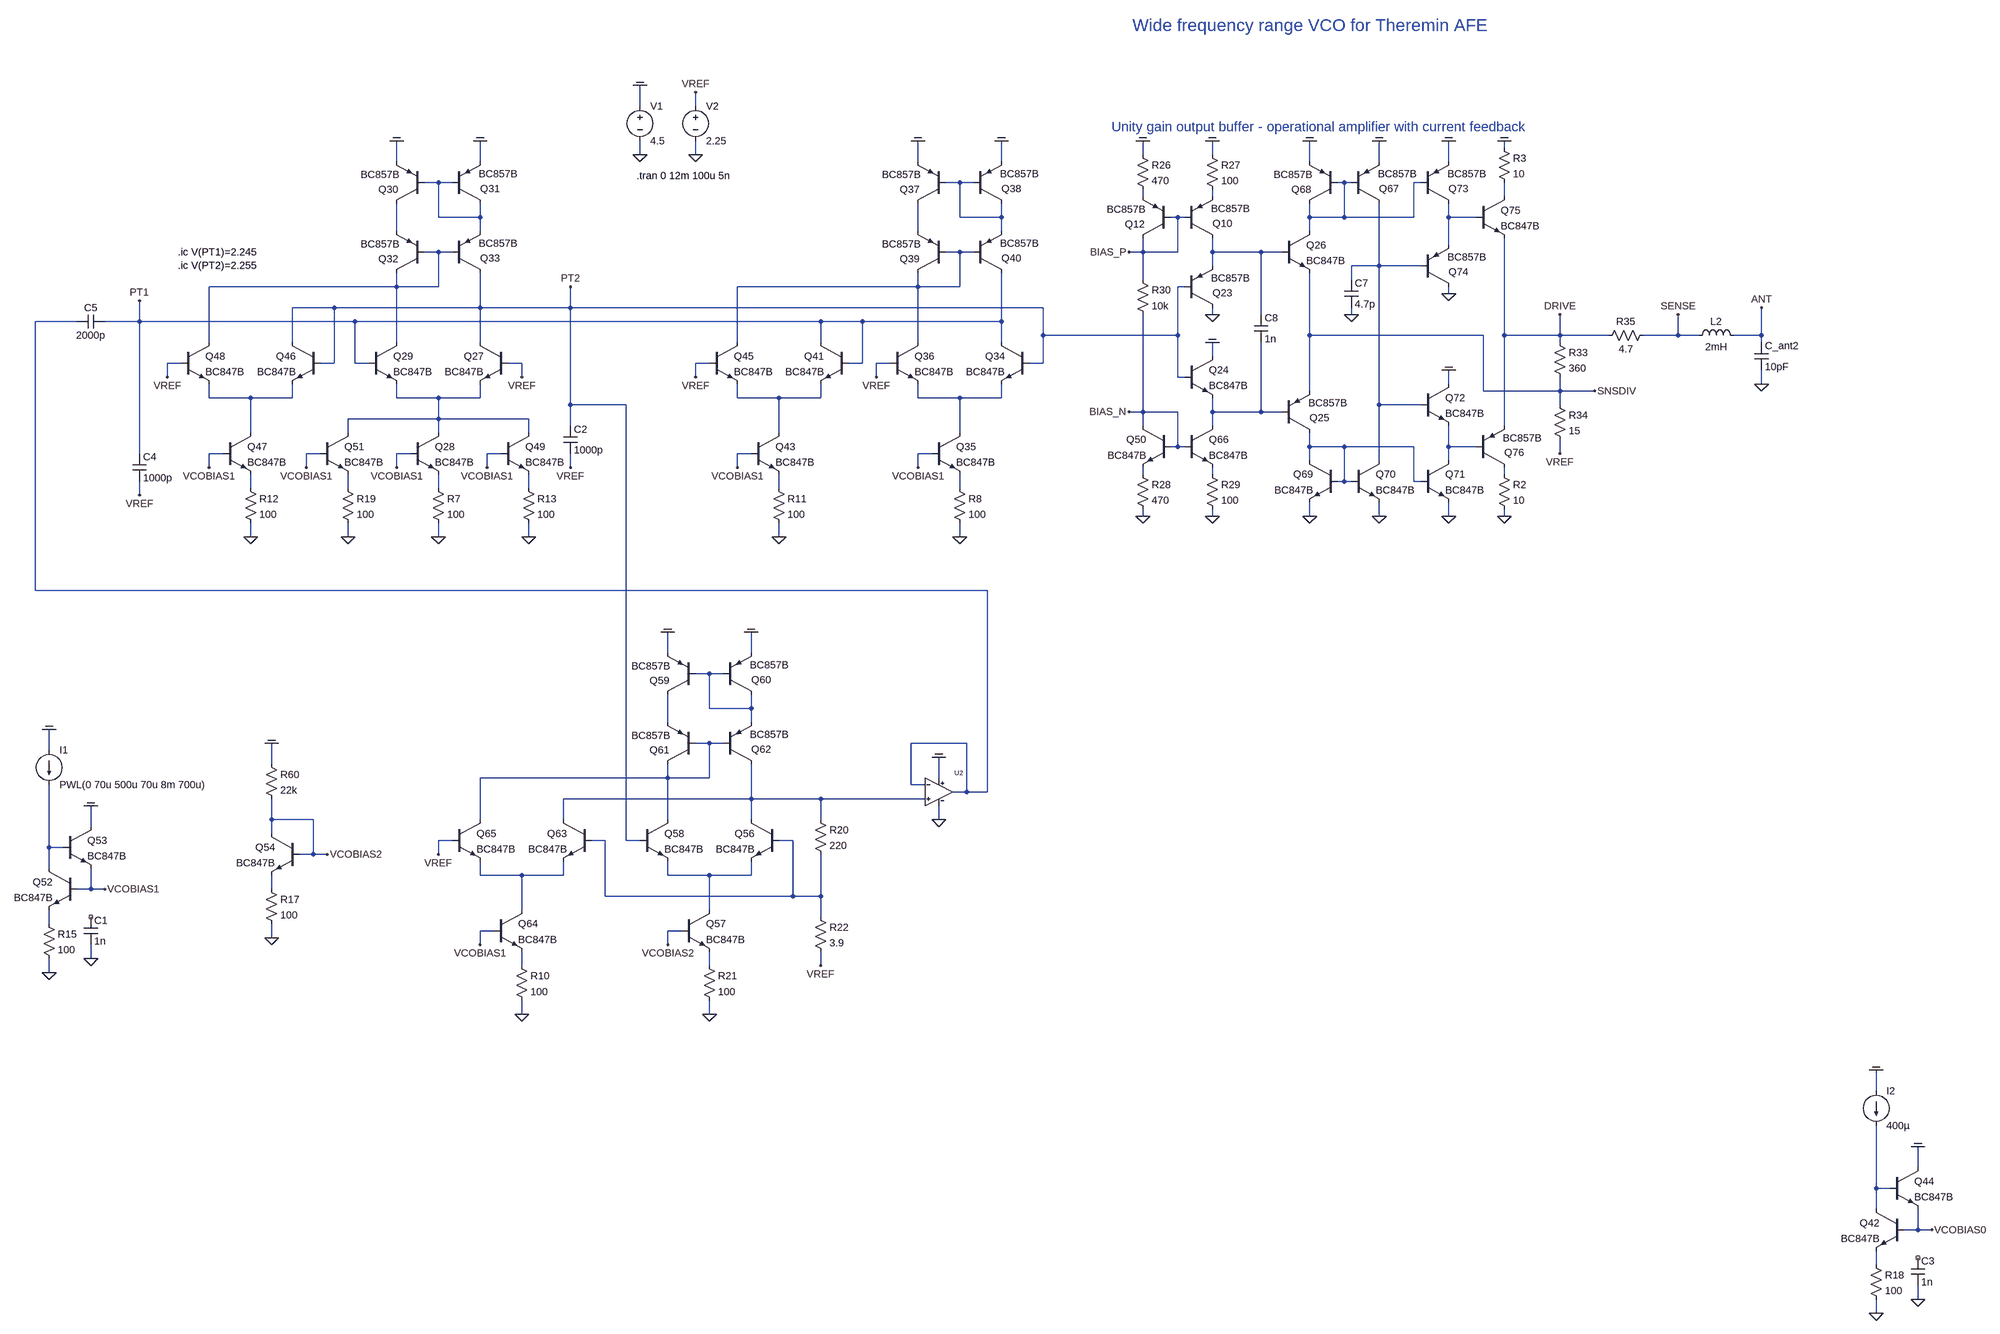
[diagram p0: schematic vco_sine_bjt_v12.asc]
vco_sine_bjt_v12.asc, the LTspice schematic file:
Version 4
SHEET 1 13504 21184
WIRE -5232 15680 -5232 15632
WIRE -5104 15680 -5104 15648
WIRE -2944 15776 -2944 15760
WIRE -5232 15792 -5232 15760
WIRE -5104 15792 -5104 15760
WIRE -3776 15792 -3776 15760
WIRE -3616 15792 -3616 15760
WIRE -5792 15808 -5792 15760
WIRE -5600 15808 -5600 15760
WIRE -4592 15808 -4592 15760
WIRE -4400 15808 -4400 15760
WIRE -3392 15808 -3392 15760
WIRE -3232 15808 -3232 15760
WIRE -3072 15808 -3072 15760
WIRE -5696 15856 -5728 15856
WIRE -5664 15856 -5696 15856
WIRE -4496 15856 -4528 15856
WIRE -4464 15856 -4496 15856
WIRE -3312 15856 -3328 15856
WIRE -3296 15856 -3312 15856
WIRE -3136 15856 -3152 15856
WIRE -3776 15888 -3776 15872
WIRE -3616 15888 -3616 15872
WIRE -2944 15888 -2944 15856
WIRE -5696 15936 -5696 15856
WIRE -5600 15936 -5600 15904
WIRE -5600 15936 -5696 15936
WIRE -4496 15936 -4496 15856
WIRE -4400 15936 -4400 15904
WIRE -4400 15936 -4496 15936
WIRE -3696 15936 -3712 15936
WIRE -3680 15936 -3696 15936
WIRE -3392 15936 -3392 15904
WIRE -3312 15936 -3312 15856
WIRE -3312 15936 -3392 15936
WIRE -3152 15936 -3152 15856
WIRE -3152 15936 -3312 15936
WIRE -3072 15936 -3072 15904
WIRE -3008 15936 -3072 15936
WIRE -5792 15968 -5792 15904
WIRE -5600 15968 -5600 15936
WIRE -4592 15968 -4592 15904
WIRE -4400 15968 -4400 15936
WIRE -3392 15968 -3392 15936
WIRE -3072 16000 -3072 15936
WIRE -5696 16016 -5728 16016
WIRE -5664 16016 -5696 16016
WIRE -4496 16016 -4528 16016
WIRE -4464 16016 -4496 16016
WIRE -3776 16016 -3776 15984
WIRE -3776 16016 -3808 16016
WIRE -3696 16016 -3696 15936
WIRE -3696 16016 -3776 16016
WIRE -3616 16016 -3616 15984
WIRE -3504 16016 -3616 16016
WIRE -3456 16016 -3504 16016
WIRE -3616 16048 -3616 16016
WIRE -3232 16048 -3232 15904
WIRE -3232 16048 -3296 16048
WIRE -3136 16048 -3232 16048
WIRE -3776 16080 -3776 16016
WIRE -3296 16080 -3296 16048
WIRE -5792 16096 -5792 16064
WIRE -5792 16096 -6224 16096
WIRE -5696 16096 -5696 16016
WIRE -5696 16096 -5792 16096
WIRE -4592 16096 -4592 16064
WIRE -4592 16096 -5008 16096
WIRE -4496 16096 -4496 16016
WIRE -4496 16096 -4592 16096
WIRE -3680 16096 -3696 16096
WIRE -3072 16112 -3072 16096
WIRE -5936 16144 -6032 16144
WIRE -5600 16144 -5600 16064
WIRE -5600 16144 -5936 16144
WIRE -5392 16144 -5392 16096
WIRE -5392 16144 -5600 16144
WIRE -4304 16144 -5392 16144
WIRE -3616 16160 -3616 16144
WIRE -3504 16160 -3504 16016
WIRE -3296 16160 -3296 16144
WIRE -6528 16176 -6624 16176
WIRE -6384 16176 -6384 16128
WIRE -6384 16176 -6464 16176
WIRE -5888 16176 -6384 16176
WIRE -4816 16176 -5888 16176
WIRE -4720 16176 -4816 16176
WIRE -4400 16176 -4400 16064
WIRE -4400 16176 -4720 16176
WIRE -4304 16208 -4304 16144
WIRE -3696 16208 -3696 16096
WIRE -3696 16208 -4304 16208
WIRE -3392 16208 -3392 16064
WIRE -2992 16208 -3392 16208
WIRE -2944 16208 -2944 15984
WIRE -2816 16208 -2816 16160
WIRE -2816 16208 -2944 16208
WIRE -2704 16208 -2816 16208
WIRE -2544 16208 -2544 16160
WIRE -2544 16208 -2624 16208
WIRE -2496 16208 -2544 16208
WIRE -2352 16208 -2352 16144
WIRE -2352 16208 -2416 16208
WIRE -6224 16224 -6224 16096
WIRE -6032 16224 -6032 16144
WIRE -5792 16224 -5792 16096
WIRE -5600 16224 -5600 16144
WIRE -5008 16224 -5008 16096
WIRE -4816 16224 -4816 16176
WIRE -4592 16224 -4592 16096
WIRE -4400 16224 -4400 16176
WIRE -2816 16224 -2816 16208
WIRE -2352 16224 -2352 16208
WIRE -3616 16256 -3616 16224
WIRE -6288 16272 -6320 16272
WIRE -5936 16272 -5936 16144
WIRE -5936 16272 -5968 16272
WIRE -5888 16272 -5888 16176
WIRE -5856 16272 -5888 16272
WIRE -5504 16272 -5536 16272
WIRE -5072 16272 -5104 16272
WIRE -4720 16272 -4720 16176
WIRE -4720 16272 -4752 16272
WIRE -4656 16272 -4688 16272
WIRE -4304 16272 -4304 16208
WIRE -4304 16272 -4336 16272
WIRE -6320 16304 -6320 16272
WIRE -5504 16304 -5504 16272
WIRE -5104 16304 -5104 16272
WIRE -4688 16304 -4688 16272
WIRE -3696 16304 -3696 16208
WIRE -3680 16304 -3696 16304
WIRE -3072 16320 -3072 16288
WIRE -2352 16320 -2352 16288
WIRE -3392 16336 -3392 16208
WIRE -2992 16336 -2992 16208
WIRE -2816 16336 -2816 16304
WIRE -2816 16336 -2992 16336
WIRE -2736 16336 -2816 16336
WIRE -6224 16352 -6224 16320
WIRE -6128 16352 -6224 16352
WIRE -6032 16352 -6032 16320
WIRE -6032 16352 -6128 16352
WIRE -5792 16352 -5792 16320
WIRE -5696 16352 -5792 16352
WIRE -5600 16352 -5600 16320
WIRE -5600 16352 -5696 16352
WIRE -5008 16352 -5008 16320
WIRE -4912 16352 -5008 16352
WIRE -4816 16352 -4816 16320
WIRE -4816 16352 -4912 16352
WIRE -4592 16352 -4592 16320
WIRE -4496 16352 -4592 16352
WIRE -4400 16352 -4400 16320
WIRE -4400 16352 -4496 16352
WIRE -5392 16368 -5392 16144
WIRE -5264 16368 -5392 16368
WIRE -3232 16368 -3232 16048
WIRE -3136 16368 -3232 16368
WIRE -2816 16368 -2816 16336
WIRE -3776 16384 -3776 16160
WIRE -3776 16384 -3808 16384
WIRE -3696 16384 -3776 16384
WIRE -3616 16384 -3616 16352
WIRE -3504 16384 -3504 16224
WIRE -3504 16384 -3616 16384
WIRE -3456 16384 -3504 16384
WIRE -5696 16400 -5696 16352
WIRE -5696 16400 -5904 16400
WIRE -5488 16400 -5696 16400
WIRE -5392 16416 -5392 16368
WIRE -3776 16416 -3776 16384
WIRE -3616 16416 -3616 16384
WIRE -2944 16416 -2944 16208
WIRE -6128 16432 -6128 16352
WIRE -5904 16432 -5904 16400
WIRE -5696 16432 -5696 16400
WIRE -5488 16432 -5488 16400
WIRE -4912 16432 -4912 16352
WIRE -4496 16432 -4496 16352
WIRE -3696 16464 -3696 16384
WIRE -3696 16464 -3712 16464
WIRE -3680 16464 -3696 16464
WIRE -3392 16464 -3392 16432
WIRE -3312 16464 -3392 16464
WIRE -3152 16464 -3312 16464
WIRE -3072 16464 -3072 16416
WIRE -3008 16464 -3072 16464
WIRE -6384 16480 -6384 16176
WIRE -6192 16480 -6224 16480
WIRE -5968 16480 -6000 16480
WIRE -5760 16480 -5792 16480
WIRE -5552 16480 -5584 16480
WIRE -4976 16480 -5008 16480
WIRE -4560 16480 -4592 16480
WIRE -2816 16480 -2816 16448
WIRE -3392 16496 -3392 16464
WIRE -3232 16496 -3232 16368
WIRE -3072 16496 -3072 16464
WIRE -6224 16512 -6224 16480
WIRE -6000 16512 -6000 16480
WIRE -5792 16512 -5792 16480
WIRE -5584 16512 -5584 16480
WIRE -5392 16512 -5392 16480
WIRE -5008 16512 -5008 16480
WIRE -4592 16512 -4592 16480
WIRE -3776 16528 -3776 16512
WIRE -3616 16528 -3616 16512
WIRE -2944 16528 -2944 16512
WIRE -3312 16544 -3312 16464
WIRE -3312 16544 -3328 16544
WIRE -3296 16544 -3312 16544
WIRE -3152 16544 -3152 16464
WIRE -3136 16544 -3152 16544
WIRE -6128 16560 -6128 16528
WIRE -5904 16560 -5904 16528
WIRE -5696 16560 -5696 16528
WIRE -5488 16560 -5488 16528
WIRE -4912 16560 -4912 16528
WIRE -4496 16560 -4496 16528
WIRE -6384 16576 -6384 16544
WIRE -3776 16624 -3776 16608
WIRE -3616 16624 -3616 16608
WIRE -3392 16624 -3392 16592
WIRE -3232 16624 -3232 16592
WIRE -3072 16624 -3072 16592
WIRE -2944 16624 -2944 16608
WIRE -6128 16672 -6128 16640
WIRE -5904 16672 -5904 16640
WIRE -5696 16672 -5696 16640
WIRE -5488 16672 -5488 16640
WIRE -4912 16672 -4912 16640
WIRE -4496 16672 -4496 16640
WIRE -6624 16800 -6624 16176
WIRE -4432 16800 -6624 16800
WIRE -5168 16944 -5168 16896
WIRE -4976 16944 -4976 16896
WIRE -5072 16992 -5104 16992
WIRE -5040 16992 -5072 16992
WIRE -5072 17072 -5072 16992
WIRE -4976 17072 -4976 17040
WIRE -4976 17072 -5072 17072
WIRE -5168 17104 -5168 17040
WIRE -4976 17104 -4976 17072
WIRE -5072 17152 -5104 17152
WIRE -5040 17152 -5072 17152
WIRE -4480 17152 -4608 17152
WIRE -6592 17168 -6592 17120
WIRE -6080 17200 -6080 17152
WIRE -5168 17232 -5168 17200
WIRE -5168 17232 -5600 17232
WIRE -5072 17232 -5072 17152
WIRE -5072 17232 -5168 17232
WIRE -4544 17232 -4544 17184
WIRE -4608 17248 -4608 17152
WIRE -4576 17248 -4608 17248
WIRE -4480 17264 -4480 17152
WIRE -4480 17264 -4512 17264
WIRE -4432 17264 -4432 16800
WIRE -4432 17264 -4480 17264
WIRE -4976 17280 -4976 17200
WIRE -4976 17280 -5408 17280
WIRE -4816 17280 -4976 17280
WIRE -4576 17280 -4816 17280
WIRE -6080 17328 -6080 17280
WIRE -5984 17328 -6080 17328
WIRE -5600 17328 -5600 17232
WIRE -5408 17328 -5408 17280
WIRE -5168 17328 -5168 17232
WIRE -4976 17328 -4976 17280
WIRE -4816 17328 -4816 17280
WIRE -4544 17328 -4544 17296
WIRE -6496 17344 -6496 17296
WIRE -6080 17360 -6080 17328
WIRE -5664 17376 -5696 17376
WIRE -5312 17376 -5344 17376
WIRE -5264 17376 -5264 16368
WIRE -5232 17376 -5264 17376
WIRE -4880 17376 -4912 17376
WIRE -6592 17392 -6592 17248
WIRE -6560 17392 -6592 17392
WIRE -5984 17408 -5984 17328
WIRE -5984 17408 -6016 17408
WIRE -5952 17408 -5984 17408
WIRE -5696 17408 -5696 17376
WIRE -6592 17440 -6592 17392
WIRE -5600 17456 -5600 17424
WIRE -5504 17456 -5600 17456
WIRE -5408 17456 -5408 17424
WIRE -5408 17456 -5504 17456
WIRE -5168 17456 -5168 17424
WIRE -5072 17456 -5168 17456
WIRE -4976 17456 -4976 17424
WIRE -4976 17456 -5072 17456
WIRE -6496 17488 -6496 17440
WIRE -6496 17488 -6528 17488
WIRE -6464 17488 -6496 17488
WIRE -6080 17488 -6080 17456
WIRE -5312 17504 -5312 17376
WIRE -4880 17504 -4880 17376
WIRE -4880 17504 -5312 17504
WIRE -4816 17504 -4816 17408
WIRE -4816 17504 -4880 17504
WIRE -5504 17536 -5504 17456
WIRE -5072 17536 -5072 17456
WIRE -4816 17552 -4816 17504
WIRE -6592 17568 -6592 17536
WIRE -5568 17584 -5600 17584
WIRE -5136 17584 -5168 17584
WIRE -6080 17600 -6080 17568
WIRE -5600 17616 -5600 17584
WIRE -5168 17616 -5168 17584
WIRE -6496 17648 -6496 17616
WIRE -5504 17664 -5504 17632
WIRE -5072 17664 -5072 17632
WIRE -4816 17664 -4816 17632
WIRE -6592 17680 -6592 17648
WIRE -5504 17776 -5504 17744
WIRE -5072 17776 -5072 17744
WIRE 1184 18336 1184 18288
WIRE 1280 18512 1280 18464
WIRE 1184 18560 1184 18416
WIRE 1216 18560 1184 18560
WIRE 1184 18608 1184 18560
WIRE 1280 18656 1280 18608
WIRE 1280 18656 1248 18656
WIRE 1312 18656 1280 18656
WIRE 1184 18736 1184 18704
WIRE 1280 18816 1280 18784
WIRE 1184 18848 1184 18816
FLAG -5232 15792 0
FLAG -5232 15632 COM
FLAG -5104 15792 0
FLAG -5104 15648 VREF
FLAG -6464 17488 VCOBIAS1
FLAG -6080 17152 COM
FLAG -6592 17120 COM
FLAG -5952 17408 VCOBIAS2
FLAG -6496 17296 COM
FLAG -6592 17680 0
FLAG -6080 17600 0
FLAG -6496 17648 0
FLAG 1312 18656 VCOBIAS0
FLAG 1184 18288 COM
FLAG 1280 18464 COM
FLAG 1184 18848 0
FLAG 1280 18816 0
FLAG -5792 16512 VCOBIAS1
FLAG -5696 16672 0
FLAG -5792 15760 COM
FLAG -5600 15760 COM
FLAG -5504 16304 VREF
FLAG -4592 16512 VCOBIAS1
FLAG -4496 16672 0
FLAG -4592 15760 COM
FLAG -4400 15760 COM
FLAG -5392 16512 VREF
FLAG -6384 16576 VREF
FLAG -5008 16512 VCOBIAS1
FLAG -4912 16672 0
FLAG -5104 16304 VREF
FLAG -4688 16304 VREF
FLAG -6224 16512 VCOBIAS1
FLAG -6128 16672 0
FLAG -6320 16304 VREF
FLAG -5584 16512 VCOBIAS1
FLAG -5488 16672 0
FLAG -6000 16512 VCOBIAS1
FLAG -5904 16672 0
FLAG -5168 17616 VCOBIAS2
FLAG -4816 17664 VREF
FLAG -5072 17776 0
FLAG -5168 16896 COM
FLAG -4976 16896 COM
FLAG -4544 17328 0
FLAG -4544 17184 COM
FLAG -5600 17616 VCOBIAS1
FLAG -5504 17776 0
FLAG -5696 17408 VREF
FLAG -6384 16128 PT1
FLAG -5392 16096 PT2
FLAG -3776 16624 0
FLAG -3616 16624 0
FLAG -3616 15760 COM
FLAG -3776 15760 COM
FLAG -3616 16160 0
FLAG -3616 16224 COM
FLAG -3808 16384 BIAS_N
FLAG -3808 16016 BIAS_P
FLAG -3232 15760 COM
FLAG -3392 15760 COM
FLAG -3392 16624 0
FLAG -3232 16624 0
FLAG -3296 16160 0
FLAG -3072 16624 0
FLAG -3072 16288 COM
FLAG -3072 15760 COM
FLAG -3072 16112 0
FLAG -2944 15760 COM
FLAG -2944 16624 0
FLAG -2816 16480 VREF
FLAG -2352 16320 0
FLAG -2352 16144 ANT
FLAG -2544 16160 SENSE
FLAG -2816 16160 DRIVE
FLAG -2736 16336 SNSDIV
SYMBOL voltage -5232 15664 R0
SYMATTR InstName V1
SYMATTR Value 4.5
SYMBOL Voltage -5104 15664 R0
SYMATTR InstName V2
SYMATTR Value 2.25
SYMBOL npn -6528 17440 M0
SYMATTR InstName Q52
SYMATTR Value BC847B
SYMBOL Res -6096 17184 R0
SYMATTR InstName R60
SYMATTR Value 22k
SYMBOL current -6592 17168 R0
SYMATTR InstName I1
SYMATTR Value PWL(0 70u 500u 70u 8m 700u)
SYMBOL npn -6016 17360 M0
SYMATTR InstName Q54
SYMATTR Value BC847B
SYMBOL npn -6560 17344 R0
SYMATTR InstName Q53
SYMATTR Value BC847B
SYMBOL Res -6608 17552 R0
SYMATTR InstName R15
SYMATTR Value 100
SYMBOL Res -6096 17472 R0
SYMATTR InstName R17
SYMATTR Value 100
SYMBOL Cap -6512 17552 R0
SYMATTR InstName C1
SYMATTR Value 1n
SYMBOL npn 1248 18608 M0
SYMATTR InstName Q42
SYMATTR Value BC847B
SYMBOL current 1184 18336 R0
SYMATTR InstName I2
SYMATTR Value 400µ
SYMBOL npn 1216 18512 R0
SYMATTR InstName Q44
SYMATTR Value BC847B
SYMBOL Res 1168 18720 R0
SYMATTR InstName R18
SYMATTR Value 100
SYMBOL Cap 1264 18720 R0
SYMATTR InstName C3
SYMATTR Value 1n
SYMBOL npn -5536 16224 M0
SYMATTR InstName Q27
SYMATTR Value BC847B
SYMBOL npn -5760 16432 R0
SYMATTR InstName Q28
SYMATTR Value BC847B
SYMBOL npn -5856 16224 R0
SYMATTR InstName Q29
SYMATTR Value BC847B
SYMBOL Res -5712 16544 R0
SYMATTR InstName R7
SYMATTR Value 100
SYMBOL pnp -5728 15904 R180
WINDOW 0 60 32 Left 2
WINDOW 3 58 66 Left 2
SYMATTR InstName Q30
SYMATTR Value BC857B
SYMBOL pnp -5664 15904 M180
WINDOW 0 64 34 Left 2
WINDOW 3 61 68 Left 2
SYMATTR InstName Q31
SYMATTR Value BC857B
SYMBOL pnp -5728 16064 R180
WINDOW 0 60 32 Left 2
WINDOW 3 58 66 Left 2
SYMATTR InstName Q32
SYMATTR Value BC857B
SYMBOL pnp -5664 16064 M180
WINDOW 0 64 34 Left 2
WINDOW 3 61 68 Left 2
SYMATTR InstName Q33
SYMATTR Value BC857B
SYMBOL npn -4336 16224 M0
SYMATTR InstName Q34
SYMATTR Value BC847B
SYMBOL npn -4560 16432 R0
SYMATTR InstName Q35
SYMATTR Value BC847B
SYMBOL npn -4656 16224 R0
SYMATTR InstName Q36
SYMATTR Value BC847B
SYMBOL Res -4512 16544 R0
SYMATTR InstName R8
SYMATTR Value 100
SYMBOL pnp -4528 15904 R180
WINDOW 0 60 32 Left 2
WINDOW 3 58 66 Left 2
SYMATTR InstName Q37
SYMATTR Value BC857B
SYMBOL pnp -4464 15904 M180
WINDOW 0 64 34 Left 2
WINDOW 3 61 68 Left 2
SYMATTR InstName Q38
SYMATTR Value BC857B
SYMBOL pnp -4528 16064 R180
WINDOW 0 60 32 Left 2
WINDOW 3 58 66 Left 2
SYMATTR InstName Q39
SYMATTR Value BC857B
SYMBOL pnp -4464 16064 M180
WINDOW 0 64 34 Left 2
WINDOW 3 61 68 Left 2
SYMATTR InstName Q40
SYMATTR Value BC857B
SYMBOL Cap -5408 16416 R0
SYMATTR InstName C2
SYMATTR Value 1000p
SYMBOL Cap -6400 16480 R0
SYMATTR InstName C4
SYMATTR Value 1000p
SYMBOL Cap -6464 16160 R90
WINDOW 0 0 32 VBottom 2
WINDOW 3 32 32 VTop 2
SYMATTR InstName C5
SYMATTR Value 2000p
SYMBOL npn -4752 16224 M0
SYMATTR InstName Q41
SYMATTR Value BC847B
SYMBOL npn -4976 16432 R0
SYMATTR InstName Q43
SYMATTR Value BC847B
SYMBOL npn -5072 16224 R0
SYMATTR InstName Q45
SYMATTR Value BC847B
SYMBOL Res -4928 16544 R0
SYMATTR InstName R11
SYMATTR Value 100
SYMBOL npn -5968 16224 M0
SYMATTR InstName Q46
SYMATTR Value BC847B
SYMBOL npn -6192 16432 R0
SYMATTR InstName Q47
SYMATTR Value BC847B
SYMBOL npn -6288 16224 R0
SYMATTR InstName Q48
SYMATTR Value BC847B
SYMBOL Res -6144 16544 R0
SYMATTR InstName R12
SYMATTR Value 100
SYMBOL npn -5552 16432 R0
SYMATTR InstName Q49
SYMATTR Value BC847B
SYMBOL Res -5504 16544 R0
SYMATTR InstName R13
SYMATTR Value 100
SYMBOL npn -5968 16432 R0
SYMATTR InstName Q51
SYMATTR Value BC847B
SYMBOL Res -5920 16544 R0
SYMATTR InstName R19
SYMATTR Value 100
SYMBOL npn -4912 17328 M0
SYMATTR InstName Q56
SYMATTR Value BC847B
SYMBOL npn -5136 17536 R0
SYMATTR InstName Q57
SYMATTR Value BC847B
SYMBOL npn -5232 17328 R0
SYMATTR InstName Q58
SYMATTR Value BC847B
SYMBOL Res -4832 17312 R0
SYMATTR InstName R20
SYMATTR Value 220
SYMBOL Res -5088 17648 R0
SYMATTR InstName R21
SYMATTR Value 100
SYMBOL Res -4832 17536 R0
SYMATTR InstName R22
SYMATTR Value 3.9
SYMBOL pnp -5104 17040 R180
WINDOW 0 60 32 Left 2
WINDOW 3 58 66 Left 2
SYMATTR InstName Q59
SYMATTR Value BC857B
SYMBOL pnp -5040 17040 M180
WINDOW 0 64 34 Left 2
WINDOW 3 61 68 Left 2
SYMATTR InstName Q60
SYMATTR Value BC857B
SYMBOL pnp -5104 17200 R180
WINDOW 0 60 32 Left 2
WINDOW 3 58 66 Left 2
SYMATTR InstName Q61
SYMATTR Value BC857B
SYMBOL pnp -5040 17200 M180
WINDOW 0 64 34 Left 2
WINDOW 3 61 68 Left 2
SYMATTR InstName Q62
SYMATTR Value BC857B
SYMBOL MCP6021 -4544 17264 R0
SYMATTR InstName U2
SYMBOL npn -5344 17328 M0
SYMATTR InstName Q63
SYMATTR Value BC847B
SYMBOL npn -5568 17536 R0
SYMATTR InstName Q64
SYMATTR Value BC847B
SYMBOL npn -5664 17328 R0
SYMATTR InstName Q65
SYMATTR Value BC847B
SYMBOL Res -5520 17648 R0
SYMATTR InstName R10
SYMATTR Value 100
SYMBOL pnp -3680 15984 M180
WINDOW 0 64 34 Left 2
WINDOW 3 61 68 Left 2
SYMATTR InstName Q10
SYMATTR Value BC857B
SYMBOL pnp -3712 15984 R180
WINDOW 0 60 32 Left 2
WINDOW 3 58 66 Left 2
SYMATTR InstName Q12
SYMATTR Value BC857B
SYMBOL pnp -3680 16144 M180
WINDOW 0 64 34 Left 2
WINDOW 3 61 68 Left 2
SYMATTR InstName Q23
SYMATTR Value BC857B
SYMBOL npn -3680 16256 R0
SYMATTR InstName Q24
SYMATTR Value BC847B
SYMBOL pnp -3456 16432 M180
WINDOW 0 64 34 Left 2
WINDOW 3 61 68 Left 2
SYMATTR InstName Q25
SYMATTR Value BC857B
SYMBOL npn -3456 15968 R0
SYMATTR InstName Q26
SYMATTR Value BC847B
SYMBOL Res -3792 15776 R0
SYMATTR InstName R26
SYMATTR Value 470
SYMBOL Res -3632 15776 R0
SYMATTR InstName R27
SYMATTR Value 100
SYMBOL Res -3792 16512 R0
SYMATTR InstName R28
SYMATTR Value 470
SYMBOL Res -3632 16512 R0
SYMATTR InstName R29
SYMATTR Value 100
SYMBOL npn -3712 16416 M0
SYMATTR InstName Q50
SYMATTR Value BC847B
SYMBOL npn -3680 16416 R0
SYMATTR InstName Q66
SYMATTR Value BC847B
SYMBOL Res -3792 16064 R0
SYMATTR InstName R30
SYMATTR Value 10k
SYMBOL pnp -3296 15904 M180
WINDOW 0 64 34 Left 2
WINDOW 3 61 68 Left 2
SYMATTR InstName Q67
SYMATTR Value BC857B
SYMBOL pnp -3328 15904 R180
WINDOW 0 60 32 Left 2
WINDOW 3 58 66 Left 2
SYMATTR InstName Q68
SYMATTR Value BC857B
SYMBOL npn -3328 16496 M0
SYMATTR InstName Q69
SYMATTR Value BC847B
SYMBOL npn -3296 16496 R0
SYMATTR InstName Q70
SYMATTR Value BC847B
SYMBOL Cap -3312 16080 R0
SYMATTR InstName C7
SYMATTR Value 4.7p
SYMBOL npn -3136 16496 R0
SYMATTR InstName Q71
SYMATTR Value BC847B
SYMBOL npn -3136 16320 R0
SYMATTR InstName Q72
SYMATTR Value BC847B
SYMBOL pnp -3136 15904 M180
WINDOW 0 64 34 Left 2
WINDOW 3 61 68 Left 2
SYMATTR InstName Q73
SYMATTR Value BC857B
SYMBOL pnp -3136 16096 M180
WINDOW 0 64 34 Left 2
WINDOW 3 61 68 Left 2
SYMATTR InstName Q74
SYMATTR Value BC857B
SYMBOL npn -3008 15888 R0
SYMATTR InstName Q75
SYMATTR Value BC847B
SYMBOL pnp -3008 16512 M180
WINDOW 0 64 34 Left 2
WINDOW 3 61 68 Left 2
SYMATTR InstName Q76
SYMATTR Value BC857B
SYMBOL Res -2832 16208 R0
SYMATTR InstName R33
SYMATTR Value 360
SYMBOL Res -2832 16352 R0
SYMATTR InstName R34
SYMATTR Value 15
SYMBOL ind -2512 16224 R270
WINDOW 0 32 56 VTop 2
WINDOW 3 5 56 VBottom 2
SYMATTR InstName L2
SYMATTR Value 2mH
SYMATTR SpiceLine Rser=120 Cpar=1pF
SYMBOL Cap -2368 16224 R0
SYMATTR InstName C_ant2
SYMATTR Value 10pF
SYMBOL Res -2720 16224 R270
WINDOW 0 32 56 VTop 2
WINDOW 3 0 56 VBottom 2
SYMATTR InstName R35
SYMATTR Value 4.7
SYMBOL Cap -3520 16160 R0
SYMATTR InstName C8
SYMATTR Value 1n
SYMBOL Res -2960 16512 R0
SYMATTR InstName R2
SYMATTR Value 10
SYMBOL Res -2960 15760 R0
SYMATTR InstName R3
SYMATTR Value 10
TEXT -5240 15840 Left 2 !.tran 0 12m 100u 5n
TEXT -3800 15472 Left 4 ;Wide frequency range VCO for Theremin AFE
TEXT -6296 16016 Left 2 !.ic V(PT1)=2.245\n.ic V(PT2)=2.255
TEXT -3848 15728 Left 3 ;Unity gain output buffer - operational amplifier with current feedback

The netlist it stands for:
* vco_sine_bjt_v12.asc
V1 COM 0 4.5
V2 VREF 0 2.25
Q52 N036 VCOBIAS1 N040 0 BC847B
R60 COM VCOBIAS2 22k
I1 COM N036 PWL(0 70u 500u 70u 8m 700u)
Q54 VCOBIAS2 VCOBIAS2 N039 0 BC847B
Q53 COM N036 VCOBIAS1 0 BC847B
R15 N040 0 100
R17 N039 0 100
C1 NC_01 0 1n
Q42 N043 VCOBIAS0 N044 0 BC847B
I2 COM N043 400µ
Q44 COM N043 VCOBIAS0 0 BC847B
R18 N044 0 100
C3 NC_02 0 1n
Q27 PT2 VREF N016 0 BC847B
Q28 N016 VCOBIAS1 N027 0 BC847B
Q29 N010 PT1 N016 0 BC847B
R7 N027 0 100
Q30 N008 N001 COM 0 BC857B
Q31 N001 N001 COM 0 BC857B
Q32 N010 N010 N008 0 BC857B
Q33 PT2 N010 N001 0 BC857B
Q34 PT1 PT2 N018 0 BC847B
Q35 N018 VCOBIAS1 N030 0 BC847B
Q36 N011 VREF N018 0 BC847B
R8 N030 0 100
Q37 N009 N002 COM 0 BC857B
Q38 N002 N002 COM 0 BC857B
Q39 N011 N011 N009 0 BC857B
Q40 PT1 N011 N002 0 BC857B
C2 PT2 VREF 1000p
C4 PT1 VREF 1000p
C5 PT1 N014 2000p
Q41 PT1 PT1 N017 0 BC847B
Q43 N017 VCOBIAS1 N029 0 BC847B
Q45 N011 VREF N017 0 BC847B
R11 N029 0 100
Q46 PT2 PT2 N015 0 BC847B
Q47 N015 VCOBIAS1 N025 0 BC847B
Q48 N010 VREF N015 0 BC847B
R12 N025 0 100
Q49 N016 VCOBIAS1 N028 0 BC847B
R13 N028 0 100
Q51 N016 VCOBIAS1 N026 0 BC847B
R19 N026 0 100
Q56 N034 N035 N038 0 BC847B
Q57 N038 VCOBIAS2 N042 0 BC847B
Q58 N033 PT2 N038 0 BC847B
R20 N034 N035 220
R21 N042 0 100
R22 N035 VREF 3.9
Q59 N032 N031 COM 0 BC857B
Q60 N031 N031 COM 0 BC857B
Q61 N033 N033 N032 0 BC857B
Q62 N034 N033 N031 0 BC857B
XU2 N034 N014 COM 0 N014 MCP6021  ; pins In+ In- V+ V- OUT
Q63 N034 N035 N037 0 BC847B
Q64 N037 VCOBIAS1 N041 0 BC847B
Q65 N033 VREF N037 0 BC847B
R10 N041 0 100
Q10 N012 BIAS_P N005 0 BC857B
Q12 BIAS_P BIAS_P N004 0 BC857B
Q23 0 PT2 N012 0 BC857B
Q24 COM PT2 N019 0 BC847B
Q25 N020 N019 SNSDIV 0 BC857B
Q26 N003 N012 SNSDIV 0 BC847B
R26 COM N004 470
R27 COM N005 100
R28 N022 0 470
R29 N023 0 100
Q50 BIAS_N BIAS_N N022 0 BC847B
Q66 N019 BIAS_N N023 0 BC847B
R30 BIAS_P BIAS_N 10k
Q67 N013 N003 COM 0 BC857B
Q68 N003 N003 COM 0 BC857B
Q69 N020 N020 0 0 BC847B
Q70 N013 N020 0 0 BC847B
C7 N013 0 4.7p
Q71 N021 N020 0 0 BC847B
Q72 COM N013 N021 0 BC847B
Q73 N007 N003 COM 0 BC857B
Q74 0 N013 N007 0 BC857B
Q75 N006 N007 DRIVE 0 BC847B
Q76 N024 N021 DRIVE 0 BC857B
R33 DRIVE SNSDIV 360
R34 SNSDIV VREF 15
L2 SENSE ANT 2mH Rser=120 Cpar=1pF
C_ant2 ANT 0 10pF
R35 DRIVE SENSE 4.7
C8 N012 N019 1n
R2 N024 0 10
R3 COM N006 10
.model NPN NPN
.model PNP PNP
.lib standard.bjt
.tran 0 12m 100u 5n
* Wide frequency range VCO for Theremin AFE
.ic V(PT1)=2.245
.ic V(PT2)=2.255
* Unity gain output buffer - operational amplifier with current feedback
.lib MCP6021.cir
.backanno
.end